# EAGLE schematic SOPAC_BUOY (EAGLE 6.5.0)

## Sheet 1 of 4
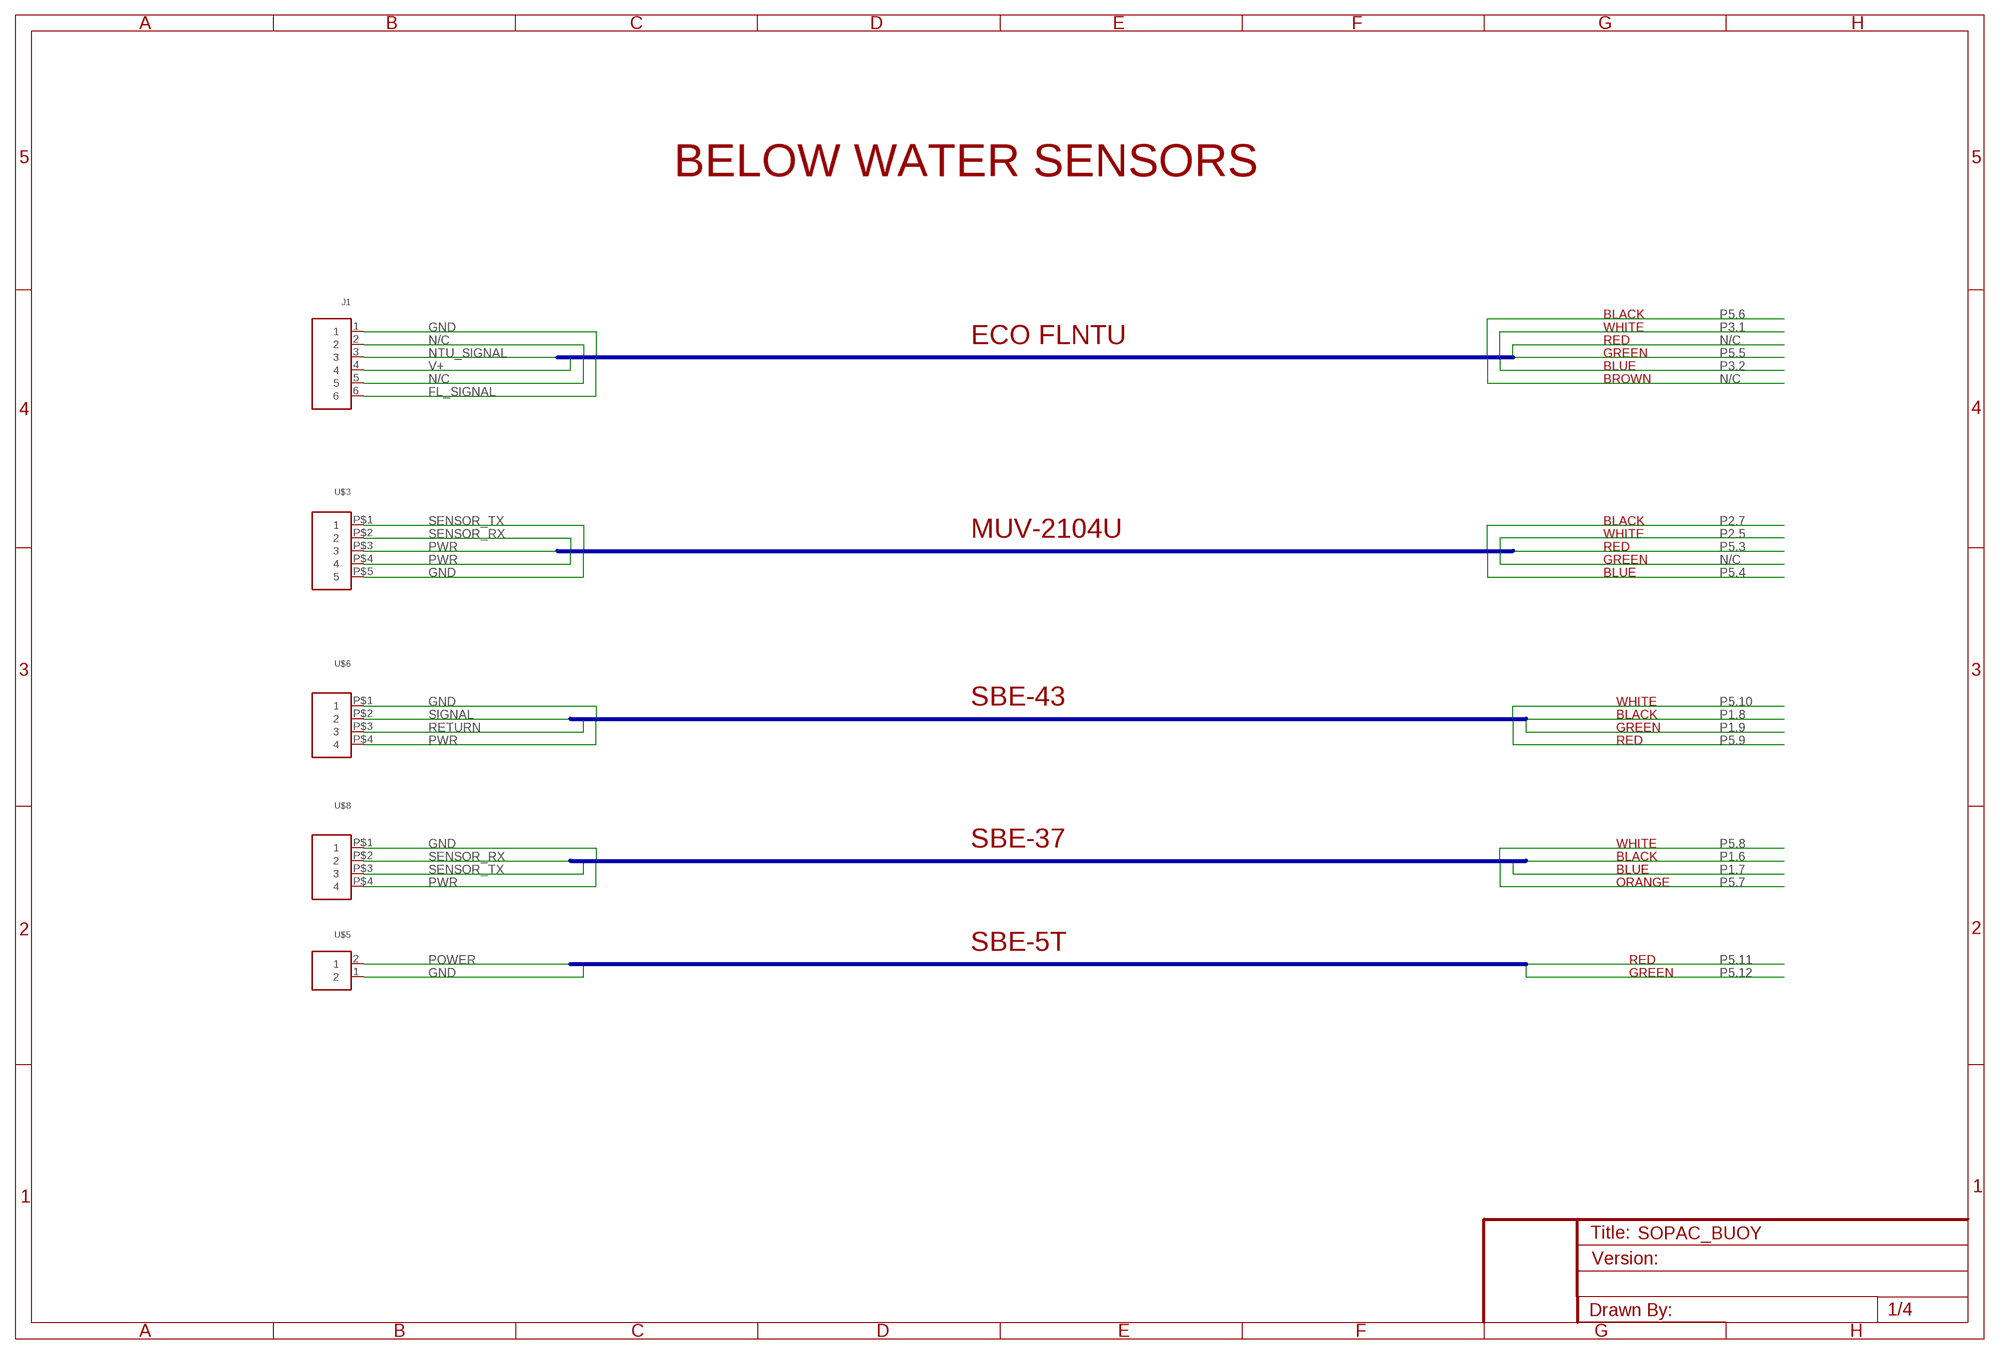
[diagram p0: schematic, sheet 1]

### Parts
J1  CONN_M1X06PHOENIX  [CONN_M1X06_PHOENIX_3.5]
U$3  CONN_M1X05.100  [CONN_M1X05_.100]
U$5  CONN_M1X02PHOENIX  [CONN_M1X02_PHOENIX_3.5]
U$6  CONN_M1X04.100  [CONN_M1X04_.100]
U$8  CONN_M1X04.100  [CONN_M1X04_.100]

### Nets
FL_SIGNAL: J1.6
GND: J1.1 U$3.P$5 U$5.1 U$6.P$1 U$8.P$1 ; also sheet 2
N/C: J1.2 J1.5 ; also sheet 2
NTU_SIGNAL: J1.3
POWER: U$5.2
PWR: U$3.P$3 U$3.P$4 U$6.P$4 U$8.P$4 ; also sheet 2
RETURN: U$6.P$3
SENSOR_RX: U$3.P$2 U$8.P$2 ; also sheet 2
SENSOR_TX: U$3.P$1 U$8.P$3 ; also sheet 2
SIGNAL: U$6.P$2
V+: J1.4 ; also sheet 2

### Buses
B$2

### Notes on the sheet
- BELOW WATER SENSORS
- BLACK
- WHITE
- ECO FLNTU | RED
- GREEN
- BLUE
- BROWN
- BLACK
- MUV-2104U | WHITE
- RED
- GREEN
- BLUE
- SBE-43 | WHITE
- BLACK
- GREEN
- RED
- SBE-37 | WHITE
- BLACK
- BLUE
- ORANGE
- SBE-5T
- RED
- GREEN

## Sheet 2 of 4
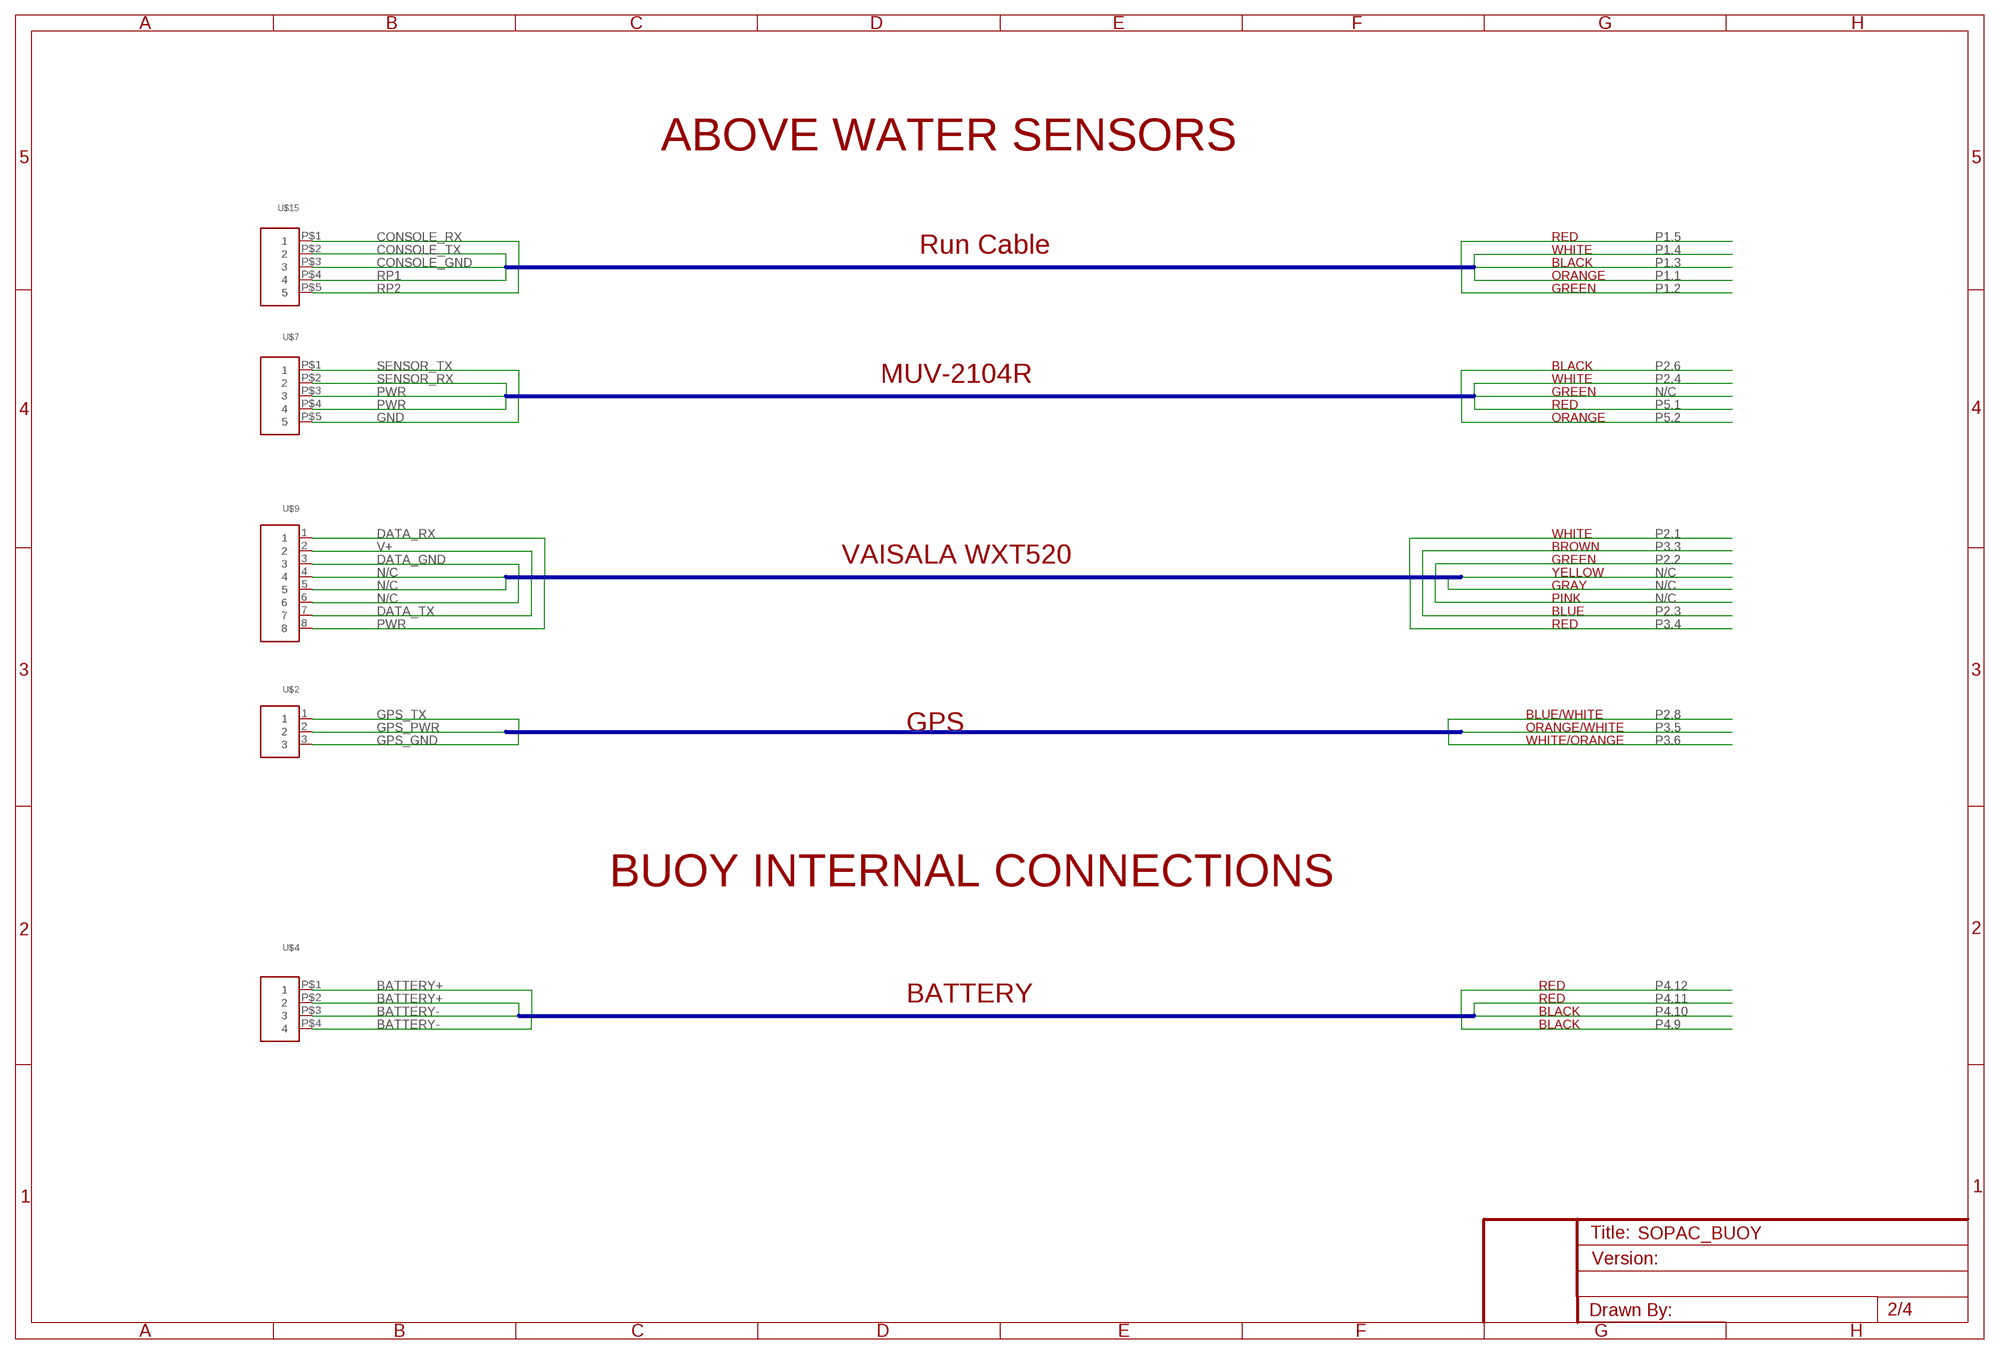
[diagram p1: schematic, sheet 2]

### Parts
U$2  CONN_M1X03PHOENIX  [CONN_M1X03_PHOENIX_3.5]
U$4  CONN_M1X04.100  [CONN_M1X04_.100]
U$7  CONN_M1X05.100  [CONN_M1X05_.100]
U$9  CONN_M1X08PHOENIX  [CONN_M1X08_PHOENIX_3.5]
U$15  CONN_M1X05.100  [CONN_M1X05_.100]

### Nets
BATTERY+: U$4.P$1 U$4.P$2 ; also sheet 4
BATTERY-: U$4.P$3 U$4.P$4 ; also sheet 4
CONSOLE_GND: U$15.P$3 ; also sheet 4
CONSOLE_RX: U$15.P$1 ; also sheet 4
CONSOLE_TX: U$15.P$2 ; also sheet 4
DATA_GND: U$9.3
DATA_RX: U$9.1
DATA_TX: U$9.7
GND: U$7.P$5 ; also sheet 1
GPS_GND: U$2.3 ; also sheet 4
GPS_PWR: U$2.2
GPS_TX: U$2.1 ; also sheet 4
N/C: U$9.4 U$9.5 U$9.6 ; also sheet 1
PWR: U$7.P$3 U$7.P$4 U$9.8 ; also sheet 1
RP1: U$15.P$4
RP2: U$15.P$5
SENSOR_RX: U$7.P$2 ; also sheet 1
SENSOR_TX: U$7.P$1 ; also sheet 1
V+: U$9.2 ; also sheet 1

### Buses
B$2
B$3
B$1

### Notes on the sheet
- ABOVE WATER SENSORS
- RED
- Run Cable | WHITE
- BLACK
- ORANGE
- GREEN
- BLACK
- MUV-2104R | WHITE
- GREEN
- RED
- ORANGE
- WHITE
- BROWN
- VAISALA WXT520 | GREEN
- YELLOW
- GRAY
- PINK
- BLUE
- RED
- BLUE/WHITE
- GPS | ORANGE/WHITE
- WHITE/ORANGE
- BUOY INTERNAL CONNECTIONS
- RED
- BATTERY | RED
- BLACK
- BLACK

## Sheet 3 of 4
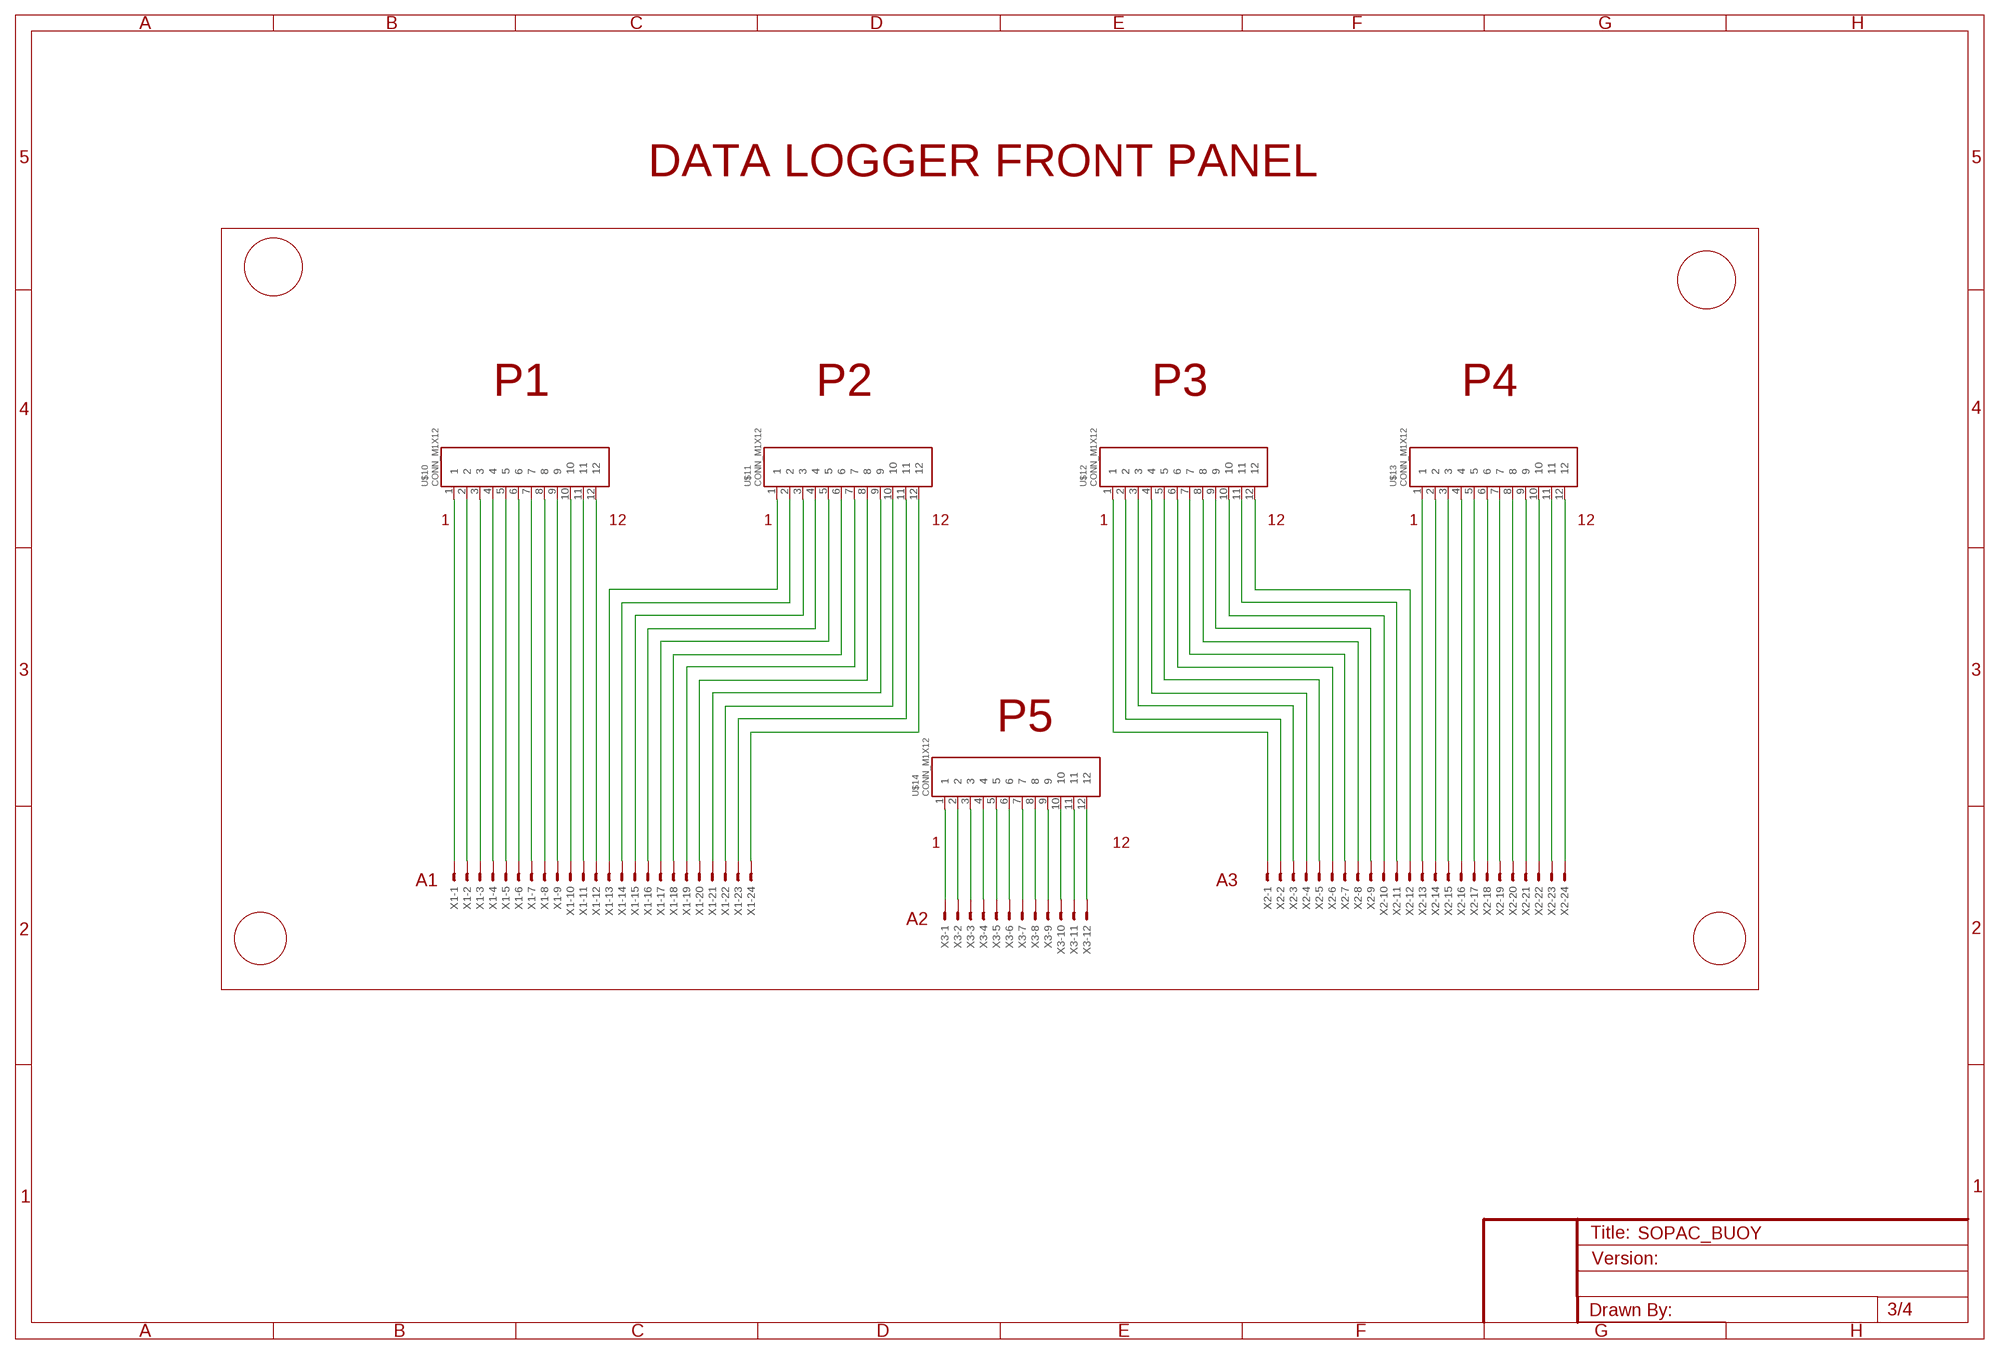
[diagram p2: schematic, sheet 3]

### Parts
U$10  CONN_M1X12  [CONN_M2X10_.100]
U$11  CONN_M1X12  [CONN_M2X10_.100]
U$12  CONN_M1X12  [CONN_M2X10_.100]
U$13  CONN_M1X12  [CONN_M2X10_.100]
U$14  CONN_M1X12  [CONN_M2X10_.100]
X1  52559-2492  [52559-2492]
X2  52559-2492  [52559-2492]
X3  52559-1292  [52559-1292]

### Nets
N$1: U$13.12 X2.24
N$2: U$13.11 X2.23
N$3: U$13.10 X2.22
N$4: U$13.8 X2.20
N$5: U$13.9 X2.21
N$6: U$13.7 X2.19
N$7: U$13.6 X2.18
N$8: U$13.5 X2.17
N$9: U$13.4 X2.16
N$10: U$13.3 X2.15
N$11: U$13.2 X2.14
N$12: U$13.1 X2.13
N$13: U$10.1 X1.1
N$14: U$10.2 X1.2
N$15: U$10.3 X1.3
N$16: U$10.4 X1.4
N$17: U$10.5 X1.5
N$18: U$10.6 X1.6
N$19: U$10.7 X1.7
N$20: U$10.8 X1.8
N$21: U$10.9 X1.9
N$22: U$10.10 X1.10
N$23: U$10.11 X1.11
N$24: U$10.12 X1.12
N$25: U$11.1 X1.13
N$26: U$11.2 X1.14
N$27: U$11.3 X1.15
N$28: U$11.4 X1.16
N$29: U$11.5 X1.17
N$30: U$11.6 X1.18
N$31: U$11.7 X1.19
N$32: U$11.8 X1.20
N$33: U$11.9 X1.21
N$34: U$11.10 X1.22
N$35: U$11.11 X1.23
N$36: U$11.12 X1.24
N$37: U$12.12 X2.12
N$38: U$12.11 X2.11
N$39: U$12.10 X2.10
N$40: U$12.9 X2.9
N$41: U$12.8 X2.8
N$42: U$12.7 X2.7
N$43: U$12.6 X2.6
N$44: U$12.5 X2.5
N$45: U$12.4 X2.4
N$46: U$12.3 X2.3
N$47: U$12.2 X2.2
N$48: U$12.1 X2.1
N$49: U$14.1 X3.1
N$50: U$14.2 X3.2
N$51: U$14.3 X3.3
N$52: U$14.4 X3.4
N$53: U$14.5 X3.5
N$54: U$14.6 X3.6
N$55: U$14.7 X3.7
N$56: U$14.8 X3.8
N$57: U$14.9 X3.9
N$58: U$14.10 X3.10
N$59: U$14.11 X3.11
N$60: U$14.12 X3.12

### Notes on the sheet
- DATA LOGGER FRONT PANEL
- P1 | P2 | P3 | P4
- 1 | 12 | 1 | 12 | 1 | 12 | 1 | 12
- P5
- 1 | 12
- A1 | A3
- A2

## Sheet 4 of 4
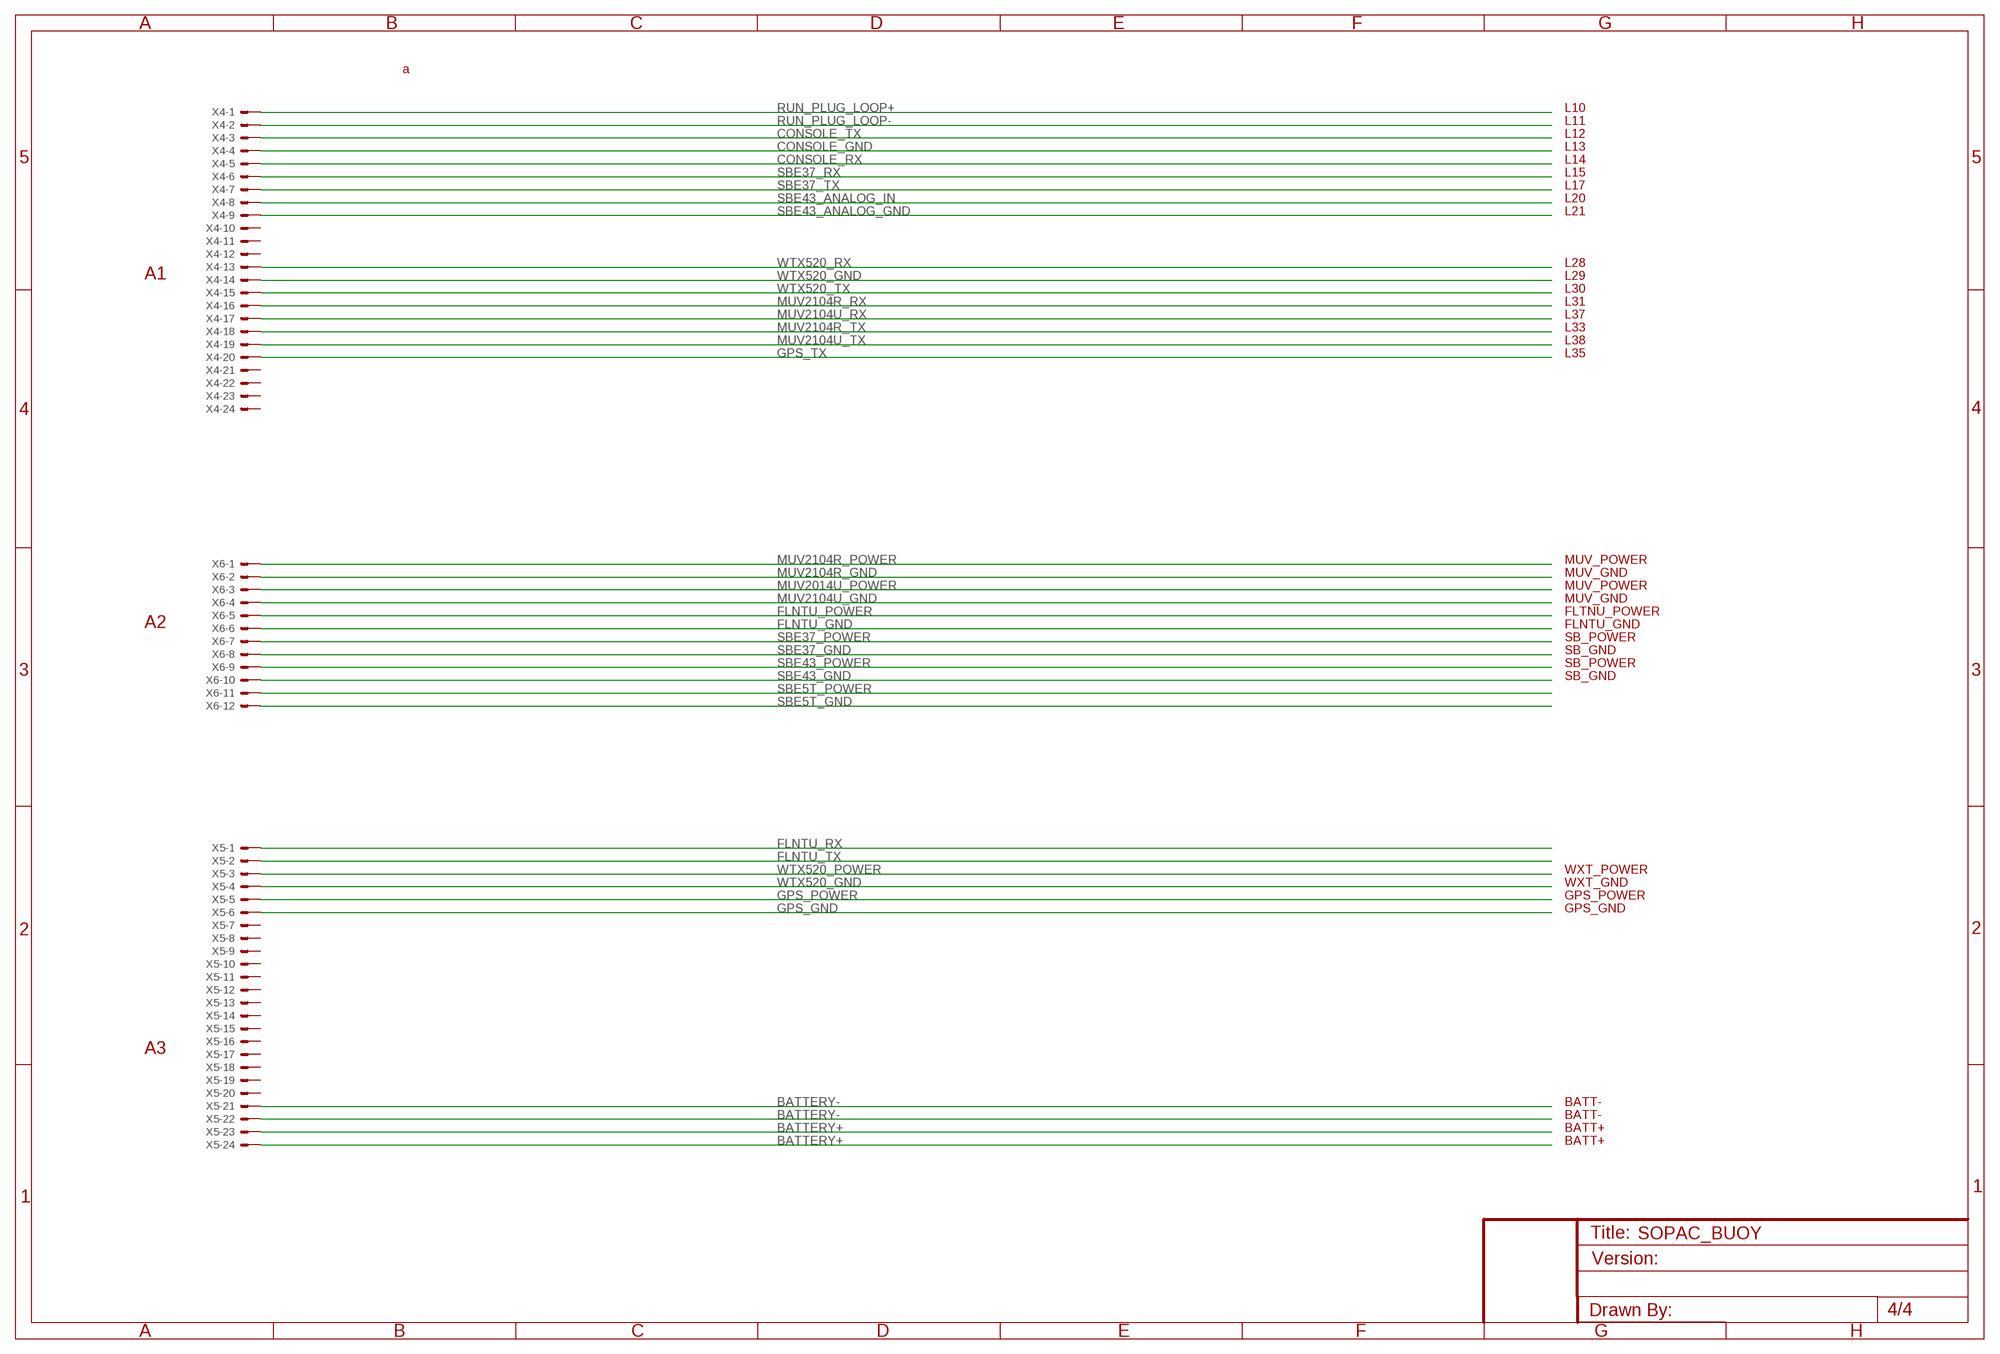
[diagram p3: schematic, sheet 4]

### Parts
X4  52745-2490  [52745-2490]
X5  52745-2490  [52745-2490]
X6  53047-12  [53047-12]

### Nets
FLNTU_GND: X6.6
FLNTU_POWER: X6.5
MUV2014U_POWER: X6.3
MUV2104R_GND: X6.2
MUV2104R_POWER: X6.1
MUV2104U_GND: X6.4
RUN_PLUG_LOOP+: X4.1
RUN_PLUG_LOOP-: X4.2
SBE5T_GND: X6.12
SBE5T_POWER: X6.11
SBE37_GND: X6.8
SBE37_POWER: X6.7
SBE43_GND: X6.10
SBE43_POWER: X6.9
Unconnected: X4.3 X4.4 X4.5 X4.6 X4.7 X4.8 X4.9 X4.10 X4.11 X4.12 X4.13 X4.14 X4.15 X4.16 X4.17 X4.18 X4.19 X4.20 X4.21 X4.22 X4.23 X4.24 X5.1 X5.2 X5.3 X5.4 X5.5 X5.6 X5.7 X5.8 X5.9 X5.10 X5.11 X5.12 X5.13 X5.14 X5.15 X5.16 X5.17 X5.18 X5.19 X5.20 X5.21 X5.22 X5.23 X5.24

### Notes on the sheet
- a
- L10
- L11
- L12
- L13
- L14
- L15
- L17
- L20
- L21
- L28
- A1 | L29
- L30
- L31
- L37
- L33
- L38
- L35
- MUV_POWER
- MUV_GND
- MUV_POWER
- MUV_GND
- FLTNU_POWER
- A2 | FLNTU_GND
- SB_POWER
- SB_GND
- SB_POWER
- SB_GND
- WXT_POWER
- WXT_GND
- GPS_POWER
- GPS_GND
- A3
- BATT-
- BATT-
- BATT+
- BATT+

## Library data of the parts
J1 = DougM-SOSI-Connector:CONN_M1X06: TERM BLOCK 5POS SOSI PN spacing manufacturer mfg pn supplier supplier pn 9210-0549 3.5MM Wurth Electronics Inc 691321100006 Digi-Key 732-2767-ND 9210-0666 ** child to 0549 above. 9210-0570 3.5MM Phoenix Contact 1985234 Digi-Key 277-1626-ND
U$2 = DougM-SOSI-Connector:CONN_M1X03: TERM BLOCK 3POS SOSI PN spacing manufacturer mfg pn supplier supplier pn 9210-0467 3.5MM Wurth Electronics Inc 691321100003 DigiKey 732-2764-ND 9210-0389 7MM FCI 20020705-M021B01LF DigiKey 609-3954-ND 9210-0568 3.5MM Phoenix 1985205 DigiKey 277-1623-ND
U$3 U$7 U$15 = DougM-SOSI-Connector:CONN_M1X05: TERM BLOCK 5POS SOSI PN spacing manufacturer mfg pn supplier supplier pn 9210-0468 3.5MM Wurth Electronics Inc 691321100005 Digikey 277-1724-ND 9210-0481 *mating connector to0468. 9210-0569 3.5mm Phoenix Contact 1985221 Digikey 277-1625-ND
U$4 U$6 U$8 = DougM-SOSI-Connector:CONN_M1X04: TERM BLOCK 4-POS SOSI PN spacing manufacturer mfg pn supplier supplier pn 9210-0663 3.5mm Wurth Electronics Inc 691321100004 Digi-Key 732-2765-ND 9210-0665 ** child to 0663 above
U$5 = DougM-SOSI-Connector:CONN_M1X02: TERM BLOCK PCB 2POS SOSI 9210-0567 Phoenix 1985195 Digi-Key 277-1622-ND SOSI 9210-0662+9210-0664 Wurth Electronics Inc 691321100002+691363110002 Digi-Key 732-2763-ND+732-2757-ND
U$9 = DougM-SOSI-Connector:CONN_M1X08: TERM BLOCK 8-POS SOSI PN spacing manufacturer mfg pn supplier supplier pn 9210-0547 3.5MM Wurth Electronics Inc 691321100008 Digi-Key 732-2768-ND 9210-0667 **child to 0547 9210-0571 3.5mm Phoenix Contact 1985250 Digi-Key 277-1628-ND
U$10-U$14 = DougM-SOSI-Connector:CONN_M1X12
X1 X2 = con-molex:52559-2492: FFC/FPC-to-Board 0.50mm (.020") SMT, Vertical, ZIF Receptacle Source: http://www.molex.com/product/ffc/52559.html; MPN: 52559-2492; OC_FARNELL: unknown; OC_NEWARK: 25M4409
X3 = con-molex:52559-1292: FFC/FPC-to-Board 0.50mm (.020") SMT, Vertical, ZIF Receptacle Source: http://www.molex.com/product/ffc/52559.html; MPN: 52559-1292; OC_FARNELL: unknown; OC_NEWARK: 91C4526
X4 X5 = con-molex:52745-2490: FFC/FPC-to-Board 0.50mm (.020") SMT Top Contact Right Angle, ZIF, Style Receptacle 52745 / 52435 Source: http://www.molex.com/product/ffc/52745.html; OC_FARNELL: unknown; OC_NEWARK: unknown
X6 = con-molex:53?-12: CONNECTOR wire to board 1.25 mm (.049 inch) pitch header; MF: WALDOM/MOLEX; MPN: 53047-1210; OC_FARNELL: 9732896; OC_NEWARK: 18M8169